# EAGLE schematic PIC18-USB+ICSP-Board (EAGLE 7.6.0)
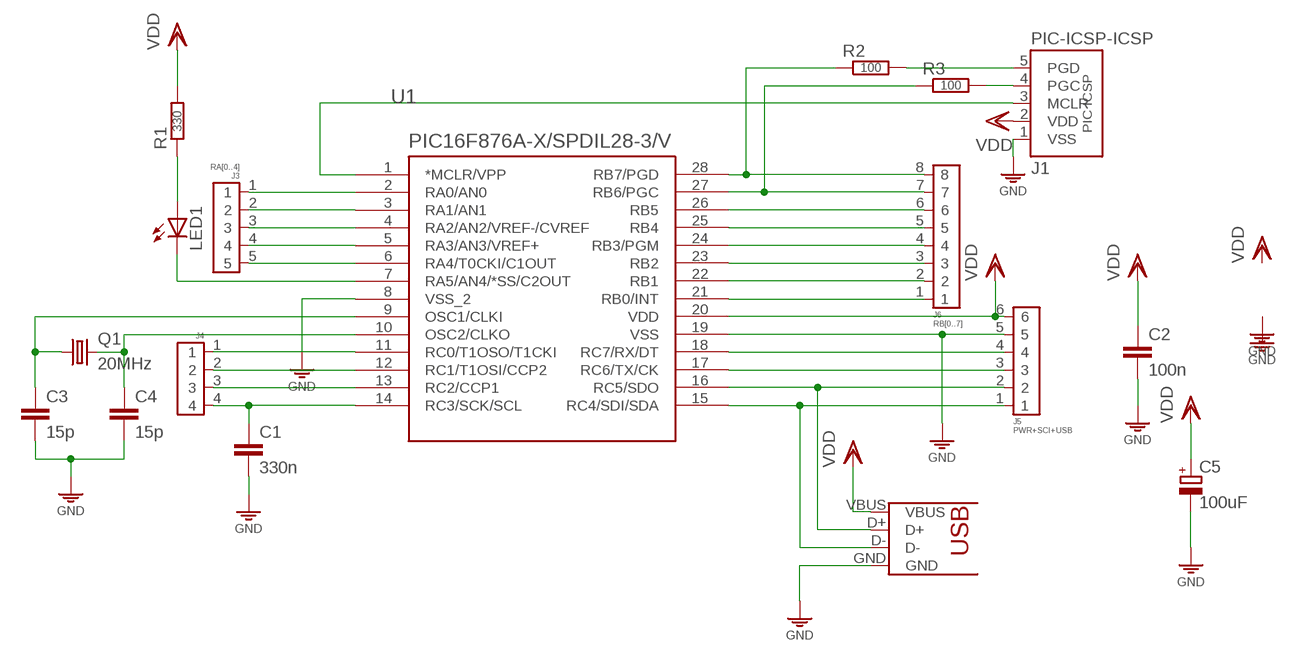
[diagram p0: schematic, sheet 1]

## Parts
C1  330n  C050-030X075  [C050-030X075]
C2  100n  C025-015X024  [C025-015X024]
C3  15p  C025-015X024  [C025-015X024]
C4  15p  C025-015X024  [C025-015X024]
C5  100uF  CPOLE2.5-5  [E2,5-5]
J1  PIC-ICSP-ICSP  [PIC-ICSP]
J2  USB-PRINT  [USB-B-PRINT]
J3  RA[0..4]  CONN-5P  [CONN-5P-N]
J4  RC[0..3]  CONN-4P-4P  [CONN-4P]
J5  PWR+SCI+USB  CONN-6P  [CONN-6P]
J6  RB[0..7]  CONN-8P  [CONN-8P]
LED1  LED3MM  [LED3MM]
Q1  20MHz  CRYSTALHC49  [HC49]
R1  330  R0202/10  [0202/10]
R2  100  R0202/7-V  [0202/7-V]
R3  100  R0202/7-V  [0202/7-V]
U1  PIC16F876A-X/SPDIL28-3/V  [DIL28-3/V]

## Nets
/MCLR: J1.3(MCLR) U1.1(*MCLR/VPP)
GND: C1.2 C2.2 C3.2 C4.2 C5.- J1.1(VSS) J2.GND J5.5 U1.8(VSS_2) U1.19(VSS)
N$1: C1.1 J4.4 U1.14(RC3/SCK/SCL)
N$2: J2.D+ J5.2 U1.16(RC5/SDO)
N$3: J2.D- J5.1 U1.15(RC4/SDI/SDA)
N$4: LED1.A R1.1
N$5: LED1.K(C) U1.7(RA5/AN4/*SS/C2OUT)
N$6: C3.1 Q1.1 U1.9(OSC1/CLKI)
N$7: C4.1 Q1.2 U1.10(OSC2/CLKO)
N$8: J6.6 U1.26(RB5)
N$9: J6.5 U1.25(RB4)
N$10: J6.4 U1.24(RB3/PGM)
N$11: J6.3 U1.23(RB2)
N$12: J6.2 U1.22(RB1)
N$13: J6.1 U1.21(RB0/INT)
N$14: J3.1 U1.2(RA0/AN0)
N$15: J5.4 U1.18(RC7/RX/DT)
N$16: J5.3 U1.17(RC6/TX/CK)
N$17: J3.2 U1.3(RA1/AN1)
N$18: J3.3 U1.4(RA2/AN2/VREF-/CVREF)
N$19: J3.4 U1.5(RA3/AN3/VREF+)
N$20: J3.5 U1.6(RA4/T0CKI/C1OUT)
N$21: J4.1 U1.11(RC0/T1OSO/T1CKI)
N$22: J4.2 U1.12(RC1/T1OSI/CCP2)
N$23: J4.3 U1.13(RC2/CCP1)
N$24: J1.5(PGD) R2.2
N$25: J1.4(PGC) R3.2
PGC: J6.7 R3.1 U1.27(RB6/PGC)
PGD: J6.8 R2.1 U1.28(RB7/PGD)
VDD: C2.1 C5.+ J1.2(VDD) J2.VBUS J5.6 R1.2 U1.20(VDD)

## Library data of the parts
C1-C4 = c:C: CAPACITOR, European symbol
C5 = c:CPOL: POLARIZED CAPACITOR, European symbol
J1 = pinconn:PIC-ICSP
J2 = usb:USB: USB Connectors USB-B-PTH is fully proven SKU : PRT-00139 USB-miniB is fully proven SKU : PRT-00587 USB-A-PCB is untested. USB-A-H is throughly reviewed, but untested. Spark Fun Electronics SKU : PRT-00437 USB-B-SMT is throughly reviewed, but untested. Needs silkscreen touching up. USB-A-S has not been used/tested USB-MB-H has not been used/tested
J3 = pinconn:CONN-5P
J4 = pinconn:CONN-4P
J5 = pinconn:CONN-6P
J6 = pinconn:CONN-8P
LED1 = led:LED: LED OSRAM: - CHIPLED LG R971, LG N971, LY N971, LG Q971, LY Q971, LO R971, LY R971 LH N974, LH R974 LS Q976, LO Q976, LY Q976 LO Q996 - Hyper CHIPLED LW Q18S LB Q993, LB Q99A, LB R99A - SideLED LS A670, LO A670, LY A670, LG A670, LP A670 LB A673, LV A673, LT A673, LW A673 LH A674 LY A675 LS A676, LA A676, LO A676, LY A676, LW A676 LS A679, LY A679, LG A679 - Hyper Micro SIDELED® LS Y876, LA Y876, LO Y876, LY Y876 LT Y87S - SmartLED LW L88C, LW L88S LB L89C, LB L89S, LG L890 LS L89K, LO L89K, LY L89K LS L896, LA L896, LO L896, LY L896 - TOPLED LS T670, LO T670, LY T670, LG T670, LP T670 LSG T670, LSP T670, LSY T670, LOP T670, LYG T670 LG T671, LOG T671, LSG T671 LB T673, LV T673, LT T673, LW T673 LH T674 LS T676, LA T676, LO T676, LY T676, LB T676, LH T676, LSB T676, LW T676 LB T67C, LV T67C, LT T67C, LS T67K, LO T67K, LY T67K, LW E67C LS E67B, LA E67B, LO E67B, LY E67B, LB E67C, LV E67C, LT E67C LW T67C LS T679, LY T679, LG T679 LS T770, LO T770, LY T770, LG T770, LP T770 LB T773, LV T773, LT T773, LW T773 LH T774 LS E675, LA E675, LY E675, LS T675 LS T776, LA T776, LO T776, LY T776, LB T776 LHGB T686 LT T68C, LB T68C - Hyper Mini TOPLED® LB M676 - Mini TOPLED Santana® LG M470 LS M47K, LO M47K, LY M47K Source: http://www.osram.convergy.de LUXEON: - LUMILED® LXK2-PW12-R00, LXK2-PW12-S00, LXK2-PW14-U00, LXK2-PW14-V00 LXK2-PM12-R00, LXK2-PM12-S00, LXK2-PM14-U00 LXK2-PE12-Q00, LXK2-PE12-R00, LXK2-PE12-S00, LXK2-PE14-T00, LXK2-PE14-U00 LXK2-PB12-K00, LXK2-PB12-L00, LXK2-PB12-M00, LXK2-PB14-N00, LXK2-PB14-P00, LXK2-PB14-Q00 LXK2-PR12-L00, LXK2-PR12-M00, LXK2-PR14-Q00, LXK2-PR14-R00 LXK2-PD12-Q00, LXK2-PD12-R00, LXK2-PD12-S00 LXK2-PH12-R00, LXK2-PH12-S00 LXK2-PL12-P00, LXK2-PL12-Q00, LXK2-PL12-R00 Source: www.luxeon.com KINGBRIGHT: KA-3528ASYC Source: www.kingbright.com
Q1 = q:CRYSTAL
R1-R3 = r:R: RESISTOR, European symbol
U1 = mcu:PIC16F876A-X/SP